# EAGLE design power (EAGLE 9.6.2)
Assembly variants: basic
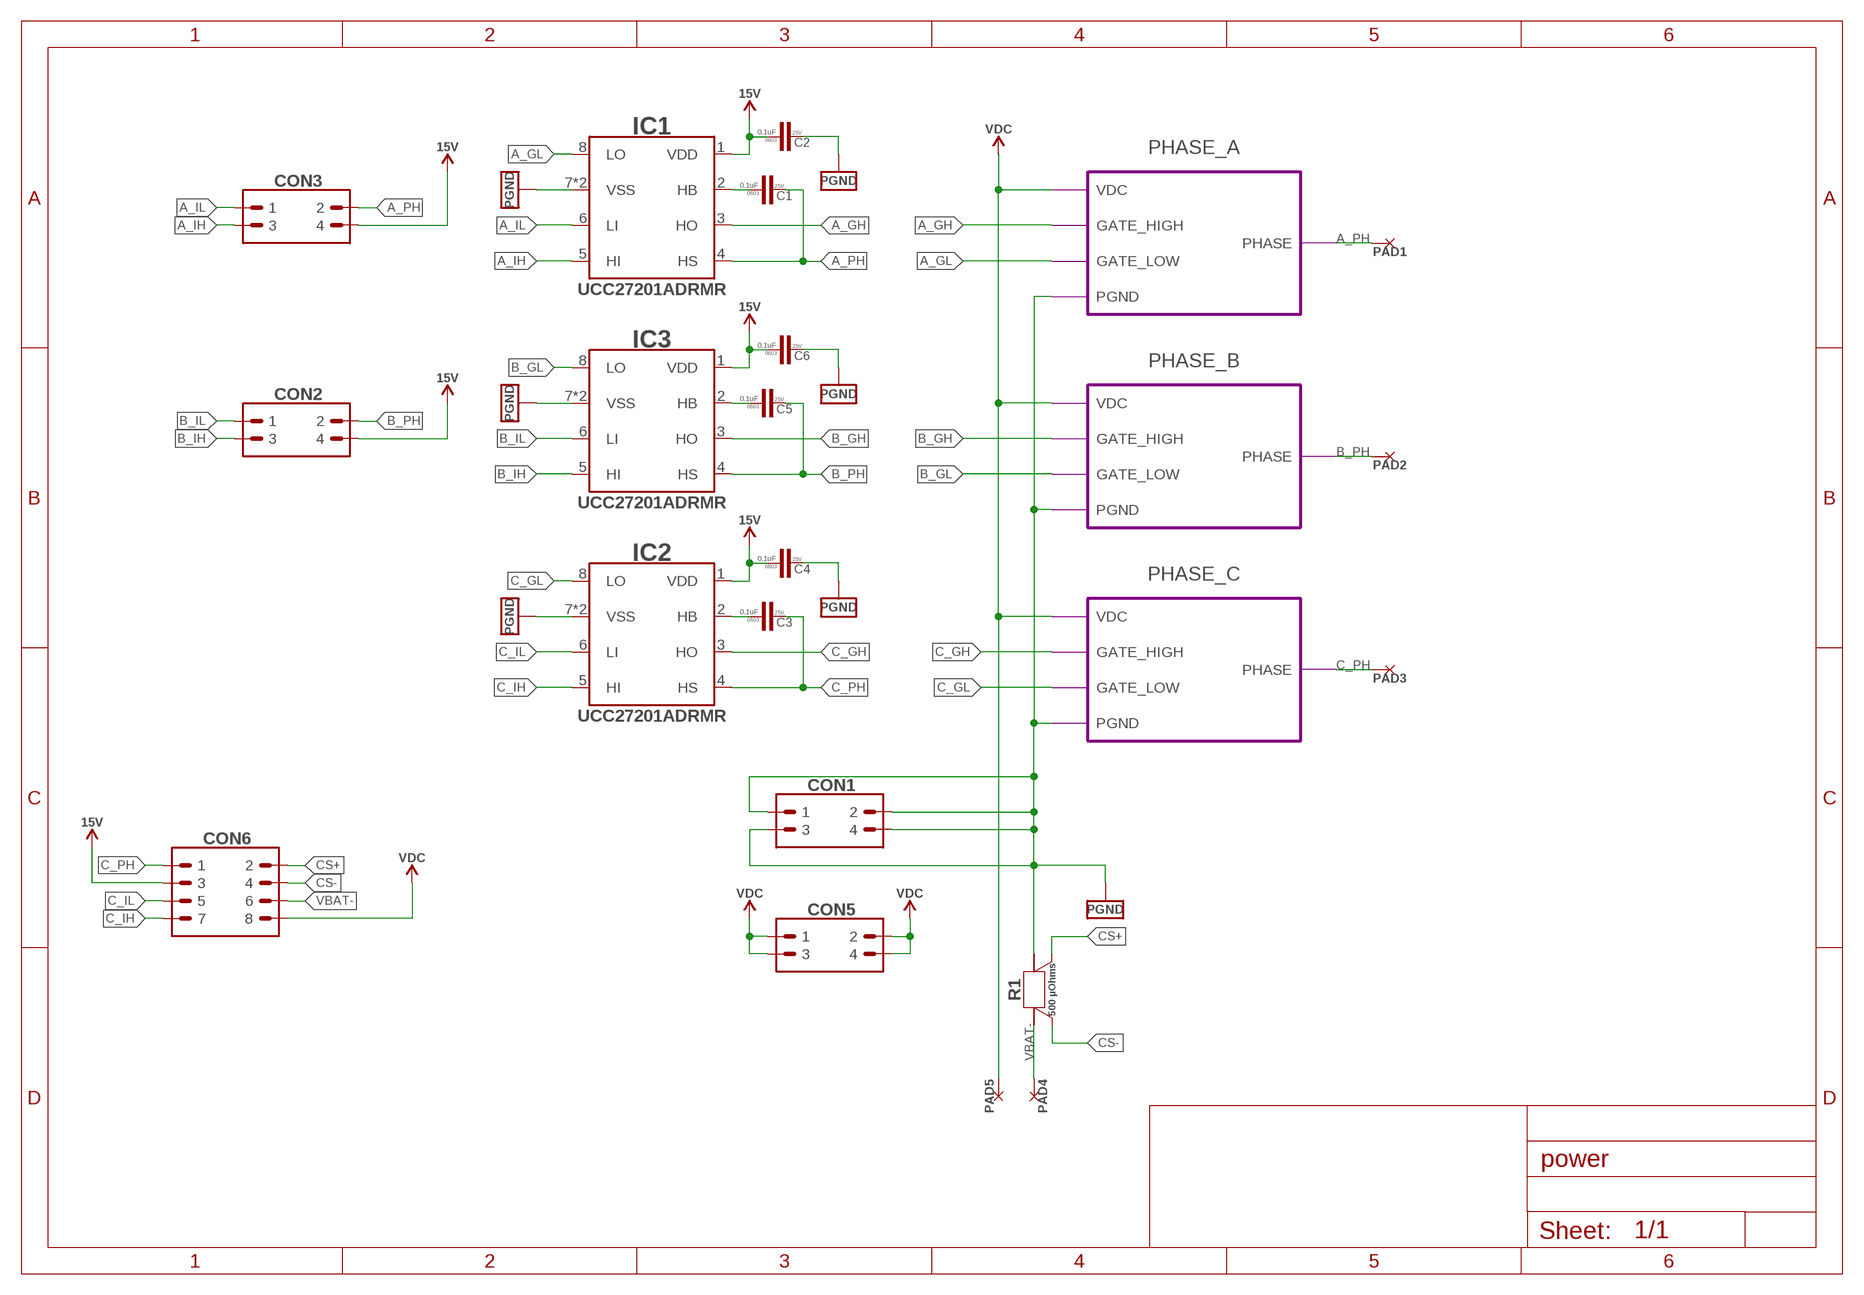
[diagram p0: schematic, sheet 1]

## Parts
C1  0.1uF  C-0603  [C0603]
C2  0.1uF  C-0603  [C0603]
C3  0.1uF  C-0603  [C0603]
C4  0.1uF  C-0603  [C0603]
C5  0.1uF  C-0603  [C0603]
C6  0.1uF  C-0603  [C0603]
CON1  PINHEAD_2X02-0877590414  [2X02-SMD-2-MALE]
CON2  PINHEAD_2X02-0877590414  [2X02-SMD-2-MALE]
CON3  PINHEAD_2X02-0877590414  [2X02-SMD-2-MALE]
CON5  PINHEAD_2X02-0877590414  [2X02-SMD-2-MALE]
CON6  PINHEAD_2X04-SMD-2-MALE  [2X04-SMD-2-MALE]
IC1  UCC272-VDFN-HEAVY_PCB  [VDFN-8-HEAVY-PCB]
IC2  UCC272-VDFN-HEAVY_PCB  [VDFN-8-HEAVY-PCB]
IC3  UCC272-VDFN-HEAVY_PCB  [VDFN-8-HEAVY-PCB]
PAD1  PAD-5X8  [5X8]  (not fitted in variant basic)
PAD2  PAD-5X8  [5X8]  (not fitted in variant basic)
PAD3  PAD-5X8  [5X8]  (not fitted in variant basic)
PAD4  PAD-5X4  [5X4]  (not fitted in variant basic)
PAD5  PAD-5X4  [5X4]  (not fitted in variant basic)
R1  500 µOhms  CURRENT_SHUNT_KELVIN-0.0005R-3920-KELVIN  [R3920-KELVIN]

## Module instances
PHASE_A = PHASE (part numbers offset by 100)
PHASE_B = PHASE (part numbers offset by 200)
PHASE_C = PHASE (part numbers offset by 300)

## Nets
A_GH: IC1.3(HO) ; port PHASE_A.GATE_HIGH
A_GL: IC1.8(LO) ; port PHASE_A.GATE_LOW
A_IH: CON3.3 IC1.5(HI)
A_IL: CON3.1 IC1.6(LI)
A_PH: C1.2 CON3.2 IC1.4(HS) PAD1.P$1 ; port PHASE_A.PHASE
B_GH: IC3.3(HO) ; port PHASE_B.GATE_HIGH
B_GL: IC3.8(LO) ; port PHASE_B.GATE_LOW
B_IH: CON2.3 IC3.5(HI)
B_IL: CON2.1 IC3.6(LI)
B_PH: C5.2 CON2.2 IC3.4(HS) PAD2.P$1 ; port PHASE_B.PHASE
C_GH: IC2.3(HO) ; port PHASE_C.GATE_HIGH
C_GL: IC2.8(LO) ; port PHASE_C.GATE_LOW
C_IH: CON6.7 IC2.5(HI)
C_IL: CON6.5 IC2.6(LI)
C_PH: C3.2 CON6.1 IC2.4(HS) PAD3.P$1 ; port PHASE_C.PHASE
CS+: CON6.2 R1.S2
CS-: CON6.4 R1.S1
N$1: C3.1 IC2.2(HB)
N$2: C5.1 IC3.2(HB)
N$13: C1.1 IC1.2(HB)
PGND: C2.2 C4.2 C6.2 CON1.1 CON1.2 CON1.3 CON1.4 IC1.7(VSS) IC1.P$1(VSS) IC2.7(VSS) IC2.P$1(VSS) IC3.7(VSS) IC3.P$1(VSS) R1.2 R1.22 ; port PHASE_A.PGND PHASE_C.PGND PHASE_B.PGND
VBAT-: CON6.6 PAD4.P$1 R1.1 R1.11
VDC [HV]: CON5.1 CON5.2 CON5.3 CON5.4 CON6.8 PAD5.P$1 ; port PHASE_B.VDC PHASE_A.VDC PHASE_C.VDC
VDD_15V: C2.1 C4.1 C6.1 CON2.4 CON3.4 CON6.3 IC1.1(VDD) IC2.1(VDD) IC3.1(VDD) ; supply symbol labelled 15V

## Library data of the parts
C1-C6 = rc:C; AEC-Q: ---; DIGIKEY#: 1276-1006-1-ND; MANF: Samsung Electro-Mechanics; MANF#: CL10B104KA8NNNC; OPERATING_TEMP: -55°C ~ 125°C; PACKAGE: 0603; VOLTAGE: 25V
CON1-CON3 CON5 = pinhead:PINHEAD_2X02; DIGIKEY#: WM18712-ND; MANF: Molex; MANF#: 0877590414
CON6 = pinhead:PINHEAD_2X04; DIGIKEY#: WM14802-ND; MANF: Molex; MANF#: 0877590814
IC1-IC3 = mosfet_drivers:UCC272: Half-Bridge Gate Driver IC Non-Inverting 8-SO PowerPad; DIGIKEY#: 296-UCC27201ADRMRTR-ND; MANF: Texas Instruments; MANF#: UCC27201ADRMR
PAD1-PAD3 = PADS:PAD
PAD4 PAD5 = PADS:PAD; BOM: EXCLUDE
R1 = SHUNT_RESISTORS:CURRENT_SHUNT_KELVIN; DIGIKEY#: CSS2H-3920R-L500FCT-ND; MANF: Bourns Inc; MANF#: CSS2H-3920R-L500F; OPERATING_TEMP: -55°C ~ 170°C; PACKAGE: 3920; POWER: 9W; TC: ±50ppm/°C; TOLERANCE: ±1%

## Module PHASE
Ports: GATE_HIGH(in) GATE_LOW(in) PHASE(io) PGND(pwr) VDC(pwr)
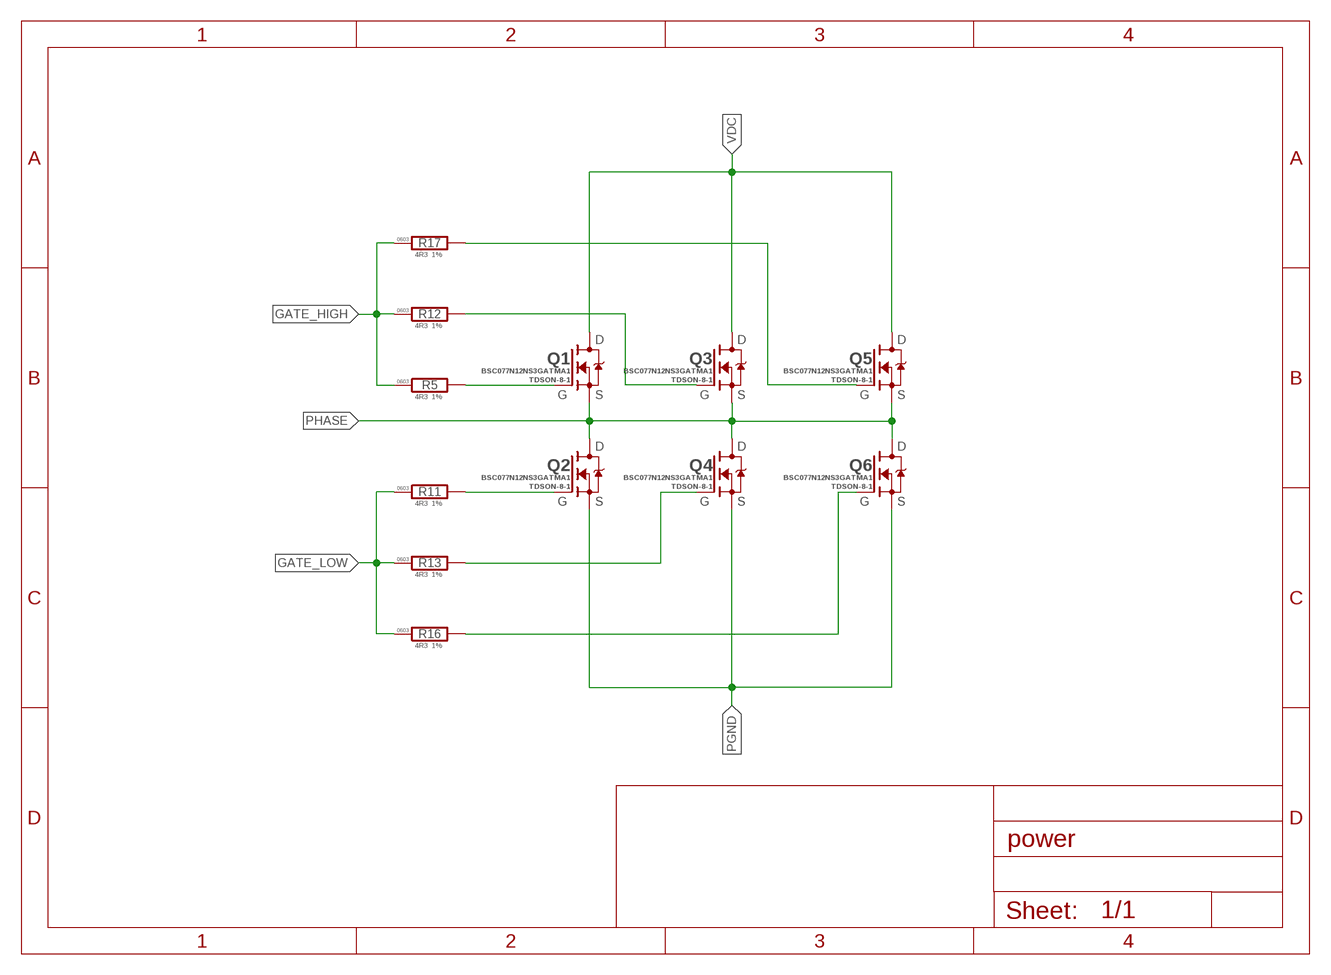
[diagram p1: schematic, module PHASE, sheet 1]

### Parts
Q1  BSC077N12NS3GATMA1  [PG-TDSON-8-1]
Q2  BSC077N12NS3GATMA1  [PG-TDSON-8-1]
Q3  BSC077N12NS3GATMA1  [PG-TDSON-8-1]
Q4  BSC077N12NS3GATMA1  [PG-TDSON-8-1]
Q5  BSC077N12NS3GATMA1  [PG-TDSON-8-1]
Q6  BSC077N12NS3GATMA1  [PG-TDSON-8-1]
R5  4R3  R-1%-0603  [R0603]
R11  4R3  R-1%-0603  [R0603]
R12  4R3  R-1%-0603  [R0603]
R13  4R3  R-1%-0603  [R0603]
R16  4R3  R-1%-0603  [R0603]
R17  4R3  R-1%-0603  [R0603]

### Nets
GATE_HIGH [HV]: R5.1 R12.1 R17.1
GATE_LOW: R11.1 R13.1 R16.1
N$1 [HV]: Q1.4(G) R5.2
N$2: Q2.4(G) R11.2
N$3 [HV]: Q3.4(G) R12.2
N$4: Q4.4(G) R13.2
N$5 [HV]: Q5.4(G) R17.2
N$6: Q6.4(G) R16.2
PGND: Q2.1(S) Q2.2(S) Q2.3(S) Q4.1(S) Q4.2(S) Q4.3(S) Q6.1(S) Q6.2(S) Q6.3(S)
PHASE [HV]: Q1.1(S) Q1.2(S) Q1.3(S) Q2.P$1(D) Q3.1(S) Q3.2(S) Q3.3(S) Q4.P$1(D) Q5.1(S) Q5.2(S) Q5.3(S) Q6.P$1(D)
VDC [HV]: Q1.P$1(D) Q3.P$1(D) Q5.P$1(D)

### Library data of the parts
Q1-Q6 = mosfet:BSC077N12NS3GATMA1: N-Channel 120V 13.4A (Ta), 98A (Tc) 139W (Tc) Surface Mount PG-TDSON-8-1; DIGIKEY#: BSC077N12NS3GATMA1CT-ND; MANF: Infineon Technologies; MANF#: BSC077N12NS3GATMA1; PACKAGE: TDSON-8-1
R5 R11-R13 R16 R17 = rc:R; AEC-Q: AEC-Q200; DIGIKEY#: 10-ERJ-U03F4R30VCT-ND; MANF: Panasonic Electronic Components; MANF#: ERJ-U03F4R30V; OPERATING_TEMP: -55°C ~ 155°C; PACKAGE: 0603; TOLERANCE: 1%

## Net classes
1 HV: clearance 0.25 mm to class 0, clearance 0.25 mm

## Board
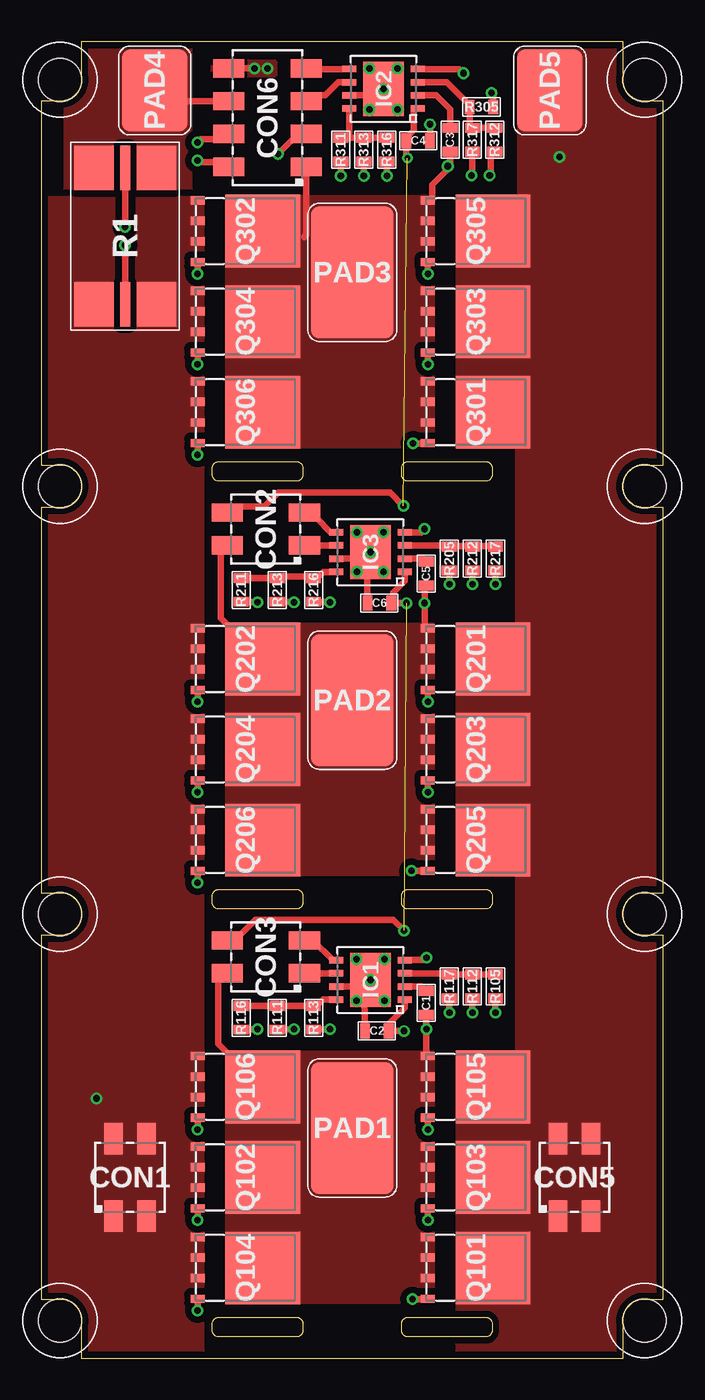
[diagram p2: board, top side]
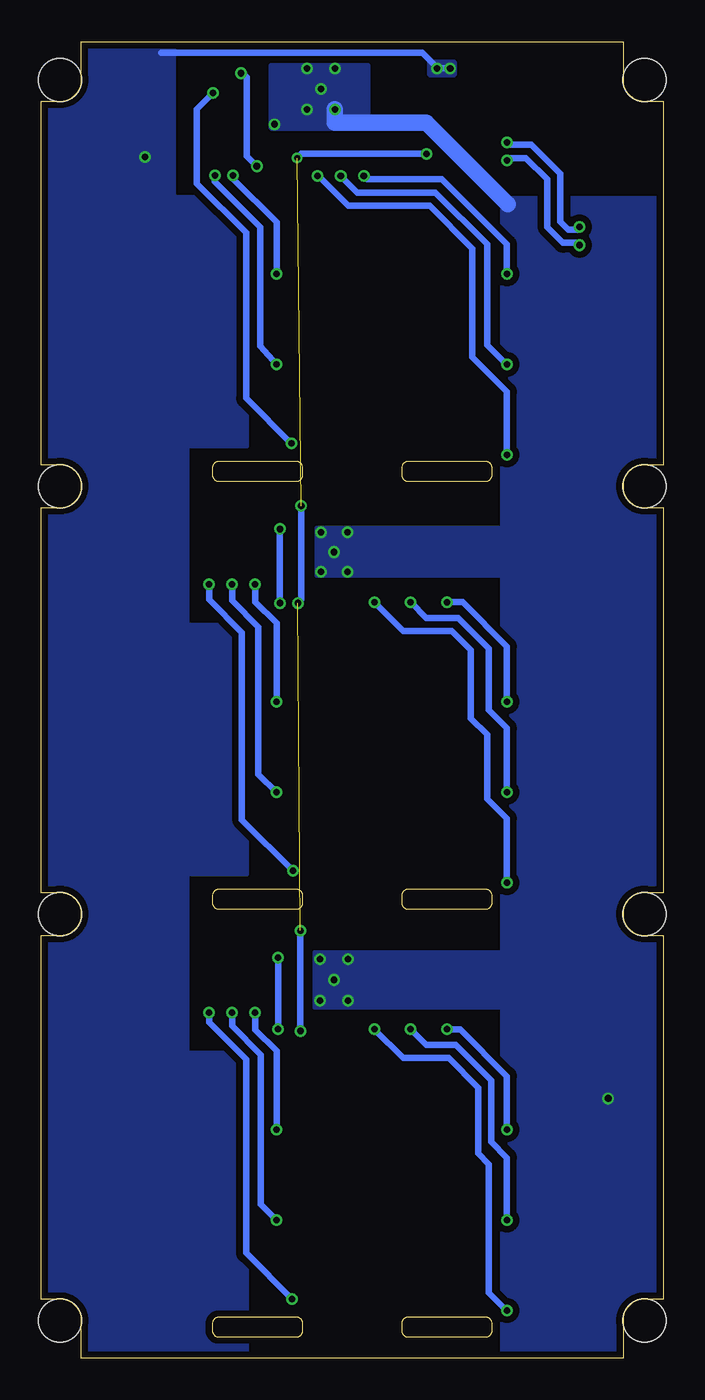
[diagram p3: board, bottom side, seen from below]

Size 37.8 x 80 mm. Coordinates in mm from the lower left corner, seen from the top.
Outline: 2.45,0 35.35,0 35.35,2.3 arc-90 36.65,3.6 37.8,3.6 37.8,25.7 36.65,25.7 arc-90 35.35,27 arc-90 36.65,28.3 37.8,28.3 37.8,51.7 36.65,51.7 arc-90 35.35,53 arc-90 36.65,54.3 37.8,54.3 37.8,76.4 36.65,76.4 arc-90 35.35,77.7 35.35,80 2.45,80 2.45,77.7 arc-90 1.15,76.4 0,76.4 0,54.3 1.15,54.3 arc-90 2.45,53 arc-90 1.15,51.7 0,51.7 0,28.3 1.15,28.3 arc-90 2.45,27 arc-90 1.15,25.7 0,25.7 0,3.6 1.15,3.6 arc-90 2.45,2.3 2.45,0
Outline: 10.8,54.5 15.5,54.5 arc-90 15.9,54.1 15.9,53.7 arc-90 15.5,53.3 10.8,53.3 arc-90 10.4,53.7 10.4,54.1 arc-90 10.8,54.5
Outline: 27.4,54.1 27.4,53.7 arc-90 27,53.3 22.3,53.3 arc-90 21.9,53.7 21.9,54.1 arc-90 22.3,54.5 27,54.5 arc-90 27.4,54.1
Outline: 10.8,28.5 15.5,28.5 arc-90 15.9,28.1 15.9,27.7 arc-90 15.5,27.3 10.8,27.3 arc-90 10.4,27.7 10.4,28.1 arc-90 10.8,28.5
Outline: 27.4,28.1 27.4,27.7 arc-90 27,27.3 22.3,27.3 arc-90 21.9,27.7 21.9,28.1 arc-90 22.3,28.5 27,28.5 arc-90 27.4,28.1
Outline: 10.8,2.5 15.5,2.5 arc-90 15.9,2.1 15.9,1.7 arc-90 15.5,1.3 10.8,1.3 arc-90 10.4,1.7 10.4,2.1 arc-90 10.8,2.5
Outline: 27.4,2.1 27.4,1.7 arc-90 27,1.3 22.3,1.3 arc-90 21.9,1.7 21.9,2.1 arc-90 22.3,2.5 27,2.5 arc-90 27.4,2.1
Copper layers (1*16): Top 0.035mm / dielectric 1mm / Bottom 0.035mm
Design rules "pwrpcb *": minimum track width 0.4mm, minimum drill 0.3mm, track to track 0.4mm, track to pad 0.4mm, pad to pad 0.4mm, via to via 0.4mm, smd to smd 0.15mm, copper to edge 0.4mm, drill to drill 0.4mm, minimum pad ring 0.15mm, minimum via ring 0.15mm, stop-mask expansion 0.41mm, vias tented up to drill 0.41mm, thermal gap 8mil
Holes 2.6 mm at 1.15,27 1.15,2.3 1.15,53 1.15,77.7 36.65,27 36.65,2.3 36.65,53 36.65,77.7

### Footprints (pad centres in the part's own frame; a part is rotated, then mirrored left to right if it is on the bottom)
C0603 = smd 0.6 x 0.9: 1 -0.725,0; 2 0.725,0
2X02-SMD-2-MALE = smd 1.9 x 1.12: 1 -2.35,1; 2 2.35,1; 3 -2.35,-1; 4 2.35,-1
2X04-SMD-2-MALE = smd 1.9 x 1.12: 1 -2.35,3; 2 2.35,3; 3 -2.35,1; 4 2.35,1; 5 -2.35,-1; 6 2.35,-1; 7 -2.35,-3; 8 2.35,-3
VDFN-8-HEAVY-PCB = smd 0.85 x 0.4: 1 -2.075,1.2; 2 -2.075,0.4; 3 -2.075,-0.4; 4 -2.075,-1.2; 5 2.075,-1.2; 6 2.075,-0.4; 7 2.075,0.4; 8 2.075,1.2 | smd 2.45 x 3.3: P$1 0,0
5X8 = smd 5 x 8: P$1 0,0
5X4 = smd 5 x 4: P$1 0,0
PG-TDSON-8-1 = smd 0.5 x 0.85: 1 -1.875,-2.9; 2 -0.625,-2.9; 3 0.625,-2.9; 4 1.875,-2.9 | smd 4.41 x 4.55: P$1 0,1.05
R3920-KELVIN = smd 2.7 x 2.4: 1 -4.15,1.9; 2 4.15,1.9; 11 -4.15,-1.9; 22 4.15,-1.9 | smd 2.7 x 0.6: S1 -4.15,0; S2 4.15,0
R0603 = smd 0.6 x 0.9: 1 -0.725,0; 2 0.725,0

### Placement (x,y rotation side)
C1  23.4,21.6 270 top
C2  20.4,19.9 180 top
C3  24.85,74.05 270 top
C4  22.9,74 0 top
C5  23.4,47.7 270 top
C6  20.55,45.9 180 top
CON1  5.4,11 90 top
CON2  13.65,50.4 180 top
CON3  13.65,24.4 180 top
CON5  32.4,11 90 top
CON6  13.75,75.4 180 top
IC1  20,23 180 top
IC2  20.8,77.15 180 top
IC3  20,49 180 top
PAD1  18.9,14 180 top
PAD2  18.9,40 180 top
PAD3  18.9,66 180 top
PAD4  6.9,77.05 270 top
PAD5  30.9,77.05 270 top
Q101  BSC077N12NS3GATMA1  [PG-TDSON-8-1]  26.4,5.5 270 top
Q102  BSC077N12NS3GATMA1  [PG-TDSON-8-1]  12.4,11 270 top
Q103  BSC077N12NS3GATMA1  [PG-TDSON-8-1]  26.4,11 270 top
Q104  BSC077N12NS3GATMA1  [PG-TDSON-8-1]  12.4,5.5 270 top
Q105  BSC077N12NS3GATMA1  [PG-TDSON-8-1]  26.4,16.5 270 top
Q106  BSC077N12NS3GATMA1  [PG-TDSON-8-1]  12.4,16.5 270 top
Q201  BSC077N12NS3GATMA1  [PG-TDSON-8-1]  26.4,42.5 270 top
Q202  BSC077N12NS3GATMA1  [PG-TDSON-8-1]  12.4,42.5 270 top
Q203  BSC077N12NS3GATMA1  [PG-TDSON-8-1]  26.4,37 270 top
Q204  BSC077N12NS3GATMA1  [PG-TDSON-8-1]  12.4,37 270 top
Q205  BSC077N12NS3GATMA1  [PG-TDSON-8-1]  26.4,31.5 270 top
Q206  BSC077N12NS3GATMA1  [PG-TDSON-8-1]  12.4,31.5 270 top
Q301  BSC077N12NS3GATMA1  [PG-TDSON-8-1]  26.4,57.5 270 top
Q302  BSC077N12NS3GATMA1  [PG-TDSON-8-1]  12.4,68.5 270 top
Q303  BSC077N12NS3GATMA1  [PG-TDSON-8-1]  26.4,63 270 top
Q304  BSC077N12NS3GATMA1  [PG-TDSON-8-1]  12.4,63 270 top
Q305  BSC077N12NS3GATMA1  [PG-TDSON-8-1]  26.4,68.5 270 top
Q306  BSC077N12NS3GATMA1  [PG-TDSON-8-1]  12.4,57.5 270 top
R1  5.1,68.2 270 top
R105  4R3  [R0603]  27.6,22.6 270 top
R111  4R3  [R0603]  14.35,20.7 270 top
R112  4R3  [R0603]  26.2,22.6 270 top
R113  4R3  [R0603]  16.55,20.7 270 top
R116  4R3  [R0603]  12.15,20.7 270 top
R117  4R3  [R0603]  24.8,22.6 270 top
R205  4R3  [R0603]  24.8,48.6 270 top
R211  4R3  [R0603]  12.15,46.7 270 top
R212  4R3  [R0603]  26.2,48.6 270 top
R213  4R3  [R0603]  14.35,46.7 270 top
R216  4R3  [R0603]  16.55,46.7 270 top
R217  4R3  [R0603]  27.6,48.6 270 top
R305  4R3  [R0603]  26.75,76.05 0 top
R311  4R3  [R0603]  18.2,73.45 270 top
R312  4R3  [R0603]  27.55,74.05 270 top
R313  4R3  [R0603]  19.6,73.45 270 top
R316  4R3  [R0603]  21,73.45 270 top
R317  4R3  [R0603]  26.2,74.05 270 top

### Tracks (layer width: path | path; a pad name or v marks a point on that pad's centre or on a via)
A_GH
  Top 0.4: R105.1 R112.1 R117.1 24.72,23.4 IC1.3
A_GL
  Top 0.4: IC1.8 17.12,21.8 16.75,21.43 R113.1 R111.1 R116.1
A_IH
  Top 0.4: IC1.5 17.7,24.2 16.5,25.4 CON3.3
A_IL
  Top 0.4: IC1.6 CON3.1
A_PH  (via drill 0.4 pad 0.7)
  Top 0.4: C1.2 v23.4,20 23.4,18.48 Q105.1 | v23.4,24.35 23.25,24.2 IC1.4 | CON3.2 10.8,23.4 10.75,23.35 10.75,19.1 13.35,16.5 Q106.P$1
  Bottom 0.4: v23.4,20 v23.4,24.35
  pour Top (no thermals): 11.27,18.6 11.27,3.4 23.82,3.4 23.82,18.6
B_GH
  Top 0.4: IC3.3 24.72,49.4 R205.1 24.85,49.38 26.15,49.38 R212.1 26.25,49.38 27.55,49.38 R217.1
B_GL
  Top 0.4: IC3.8 17.15,47.8 16.67,47.33 16.55,47.33 R216.1 16.45,47.52 14.45,47.52 R213.1 R211.1
B_IH
  Top 0.4: CON2.3 16.3,51.1 16.7,51.1 17.6,50.2 IC3.5
B_IL
  Top 0.4: CON2.1 16.15,49.55 16.3,49.4 IC3.6
B_PH  (via drill 0.4 pad 0.7)
  Top 0.4: C5.2 23.3,46.88 v23.3,45.9 23.3,44.58 Q201.1 | IC3.4 23.1,50.2 v23.3,50.4 | CON2.2 10.9,49 10.9,45 13.4,42.5 Q202.P$1
  Bottom 0.4: v23.3,50.4 v23.3,45.9
  pour Top (no thermals): 11.27,44.6 11.27,29.4 23.82,29.4 23.82,44.6
C_GH
  Top 0.4: IC2.3 24.63,77.55 26.02,76.16 R305.1 26.02,74.95 R317.1 R312.1
C_GL
  Top 0.4: IC2.8 18.72,74.2 18.7,74.17 R311.1 R313.1 R316.1
C_IH
  Top 0.4: IC2.5 16.15,78.35 CON6.7
C_IL
  Top 0.4: IC2.6 18.05,77.55 17.25,76.75 16.45,76.75 CON6.5
C_PH  (via drill 0.4 pad 0.7)
  Top 0.4: C3.2 24.85,72.45 v24.7,72.45 24.7,72.28 23.75,71.33 23.75,70.42 23.7,70.38 Q305.1 | v25.65,78.1 25.4,78.35 IC2.4 | CON6.1 16.1,68.28 15.97,68.15
  Bottom 0.4: v25.65,78.1 25.55,78.1 25.3,77.85 25.3,73.05 v24.7,72.45
  pour Top (no thermals): 11.27,70.6 11.27,55.4 23.82,55.4 23.82,70.6
CS+  (via drill 0.4 pad 0.7)
  Top 0.4: R1.S2 v5.1,67.65 | CON6.2 11.1,72.7 9.6,72.7 v9.5,72.8
  Bottom 0.4: v9.5,72.8 9.35,72.95 8.35,72.95 7.05,71.65 7.05,68.75 6.1,67.8 5.25,67.8 v5.1,67.65
CS-  (via drill 0.4 pad 0.7)
  Top 0.4: R1.S1 v5.1,68.75 | CON6.4 11.1,74.1 9.7,74.1 v9.5,73.9
  Bottom 0.4: v9.5,73.9 9.35,73.75 8.02,73.75 6.25,71.98 6.25,69.08 5.77,68.6 5.25,68.6 v5.1,68.75
N$1
  Top 0.4: C3.1 24.85,75.9 24,76.75 IC2.2
N$2
  Top 0.4: IC3.2 23.22,48.6 C5.1
N$13
  Top 0.4: IC1.2 23.12,22.6 C1.1
PGND  (via drill 0.4 pad 0.7)
  Top 0.4: 21.17,76.78 IC2.P$1 20.4,76.75 IC2.7 | IC3.7 19.6,48.6 IC3.P$1 19.82,48.83 C6.2 | IC1.7 19.4,22.6 19.8,23 IC1.P$1 19.6,22.6 C2.2 | C4.2 v23.62,75
  Bottom 1: v19.95,75.9 19.95,75.1 14.4,75.1 9.45,70.15
  other vias: 20,49 20.8,50.2 19.2,50.2 19.2,47.8 20.8,47.8 20.8,77.15 21.65,75.9 21.65,78.4 19.95,78.4 19.15,24.25 20.85,24.25 19.15,21.75 20.85,21.75 20,23 3.35,15.8
  pour Top (no thermals): 9.82,0 9.82,70.55 -0.1,70.55 -0.1,0
  pour Bottom (no thermals): 9.82,0 9.82,21.3 21.2,21.3 21.2,24.7 9.82,24.7 9.82,47.55 21.1,47.55 21.1,50.5 9.82,50.5 9.82,70.55 -0.1,70.55 -0.1,0
  pour Bottom: 18,78.55 18,74.8 23.8,74.8 23.8,78.55
PHASE_A:N$1  (via drill 0.4 pad 0.7)
  Top 0.4: Q101.4 23.47,3.6 v22.55,3.6 | R105.2 v27.6,21
  Bottom 0.4: v22.55,3.6 25.35,6.4 25.35,18.17 27.6,20.42 v27.6,21
PHASE_A:N$2  (via drill 0.4 pad 0.7)
  Top 0.4: R111.2 14.37,20 v15.35,20 | Q102.4 v9.5,8.4
  Bottom 0.4: v9.5,8.4 9.5,12.2 10.45,13.15 10.45,16.9 12.6,19.05 14.4,19.05 v15.35,20
PHASE_A:N$3  (via drill 0.4 pad 0.7)
  Top 0.4: v23.5,8.4 Q103.4 | R112.2 v26.2,21
  Bottom 0.4: v26.2,21 26.2,20.2 24.45,18.45 24.45,9.35 v23.5,8.4
PHASE_A:N$4  (via drill 0.4 pad 0.7)
  Top 0.4: R113.2 16.57,20 v17.55,20 | Q104.4 v9.5,2.9
  Bottom 0.4: v9.5,2.9 10.6,4 10.6,11.8 11.25,12.45 11.25,16.45 13.05,18.25 15.8,18.25 v17.55,20
PHASE_A:N$5  (via drill 0.4 pad 0.7)
  Top 0.4: Q105.4 v23.5,13.9 | R117.2 v24.8,21
  Bottom 0.4: v24.8,21 24.8,19.98 23.5,18.68 v23.5,13.9
PHASE_A:N$6  (via drill 0.4 pad 0.7)
  Top 0.4: R116.2 12.17,20 v13.15,20 | Q106.4 v9.5,13.9
  Bottom 0.4: v9.5,13.9 9.5,17.15 12.35,20 v13.15,20
PHASE_B:N$1  (via drill 0.4 pad 0.7)
  Top 0.4: Q201.4 v23.5,39.9 | R205.2 v24.8,47.05
  Bottom 0.4: v24.8,47.05 24.8,45.98 23.5,44.67 v23.5,39.9
PHASE_B:N$2  (via drill 0.4 pad 0.7)
  Top 0.4: Q202.4 v9.5,39.9 | v13.15,45.95 12.17,45.95 R211.2
  Bottom 0.4: v9.5,39.9 9.5,43.25 12.2,45.95 v13.15,45.95
PHASE_B:N$3  (via drill 0.4 pad 0.7)
  Top 0.4: Q203.4 v23.5,34.4 | R212.2 v26.2,47.05
  Bottom 0.4: v23.5,34.4 24.6,35.48 24.6,44.44 26.2,46.04 v26.2,47.05
PHASE_B:N$4  (via drill 0.4 pad 0.7)
  Top 0.4: Q204.4 v9.5,34.4 | v15.35,45.95 14.37,45.95 R213.2
  Bottom 0.4: v9.5,34.4 9.5,38.3 10.6,39.4 10.6,43.15 12.45,45 14.4,45 v15.35,45.95
PHASE_B:N$5  (via drill 0.4 pad 0.7)
  Top 0.4: Q205.4 v22.5,29.62 | R217.2 v27.6,47.05
  Bottom 0.4: v27.6,47.05 27.6,46.1 25.6,44.1 25.6,32.73 v22.5,29.62
PHASE_B:N$6  (via drill 0.4 pad 0.7)
  Top 0.4: Q206.4 v9.5,28.9 | v17.55,45.95 16.57,45.95 R216.2
  Bottom 0.4: v9.5,28.9 9.5,32.8 10.7,34 10.7,37.9 11.7,38.9 11.7,43.05 12.85,44.2 15.8,44.2 v17.55,45.95
PHASE_C:N$1  (via drill 0.4 pad 0.7)
  Top 0.4: Q301.4 23.47,55.6 v22.6,55.6 | R305.2 27.47,76.9 v27.35,76.9
  Bottom 0.4: v27.35,76.9 28.35,75.9 28.35,71.4 25.35,68.4 25.35,58.35 v22.6,55.6
PHASE_C:N$2  (via drill 0.4 pad 0.7)
  Top 0.4: R311.2 v18.2,71.85 | Q302.4 v9.5,65.9
  Bottom 0.4: v18.2,71.85 18,71.65 13.45,71.65 9.5,67.7 v9.5,65.9
PHASE_C:N$3  (via drill 0.4 pad 0.7)
  Top 0.4: Q303.4 v23.5,60.4 | R312.2 27.3,73.08 27.3,71.95 v27.25,71.9
  Bottom 0.4: v27.25,71.9 27.25,71.5 24.5,68.75 24.5,61.5 v23.5,60.4
PHASE_C:N$4  (via drill 0.4 pad 0.7)
  Top 0.4: R313.2 v19.6,71.85 | Q304.4 v9.5,60.4
  Bottom 0.4: v9.5,60.4 10.7,61.58 10.7,67.7 13.85,70.85 18.6,70.85 v19.6,71.85
PHASE_C:N$5  (via drill 0.4 pad 0.7)
  Top 0.4: R317.2 26.2,71.95 v26.15,71.9 | Q305.4 v23.5,65.9
  Bottom 0.4: v26.15,71.9 26.15,71.7 23.5,69.05 v23.5,65.9
PHASE_C:N$6  (via drill 0.4 pad 0.7)
  Top 0.4: R316.2 v21,71.85 | Q306.4 v9.5,54.9
  Bottom 0.4: v9.5,54.9 9.5,58.75 11.6,60.85 11.6,67.45 14.2,70.05 19.15,70.05 20.95,71.85 v21,71.85
VBAT-
  Top 0.4: CON6.6 6.9,76.4 PAD4.P$1
  pour Top (rank 2, no thermals): 1.42,80 9.12,80 9.12,70.38 1.42,70.38
VDC  (via drill 0.4 pad 0.7)
  Top 0.4: CON6.8 v12.95,78.4
  Bottom 0.4: v12.95,78.4 13.7,78.4 14.65,79.35 30.5,79.35
  other vias: 31.5,73 13.75,78.4
  pour Top (no thermals): 25.27,0 25.27,18.6 28.9,18.6 28.9,29.4 25.27,29.4 25.27,44.6 28.9,44.6 28.9,55.4 25.27,55.4 25.27,70.6 29,70.6 29,80 37.9,80 37.9,0
  pour Bottom (no thermals): 25.27,0 25.27,18.6 28.9,18.6 28.9,29.4 25.27,29.4 25.27,44.6 28.9,44.6 28.9,55.4 25.27,55.4 25.27,70.6 29.7,70.6 29.7,80 37.9,80 37.9,0
  pour Top: 10.5,78.75 14.15,78.75 14.15,78.05 10.5,78.05
  pour Bottom: 14.15,78.75 12.75,78.75 12.75,78.05 14.15,78.05
VDD_15V  (via drill 0.35, 0.4 pad 0.7)  (2 unrouted)
  Top 0.4: CON2.4 11.65,51.75 13.55,51.75 14.4,52.6 21.2,52.6 v22,51.8 | v22.2,45.9 C6.1 21.38,46 21.38,46.52 22.07,47.23 IC3.1 | 22.2,21.8 IC1.1 22.07,21.3 21.22,20.45 21.22,20 C2.1 v22.05,19.9 | IC2.1 22.72,75.95 22.65,75.88 22.65,74.64 22.17,74.16 C4.1 22.17,73.03 v22.25,72.95 | CON3.4 11.75,25.4 13,26.65 21.4,26.65 v22.05,26 | CON6.3 15.6,74.4 v14.4,73.2
  Bottom 0.4: v22,51.8 22,46.1 v22.2,45.9 | v22.05,26 v22.05,19.9 | v14.4,73.2 22,73.2 v22.25,72.95